# EAGLE schematic cem3350 iteration 3 opamp buffer cv 0.3 (EAGLE 9.3.0)
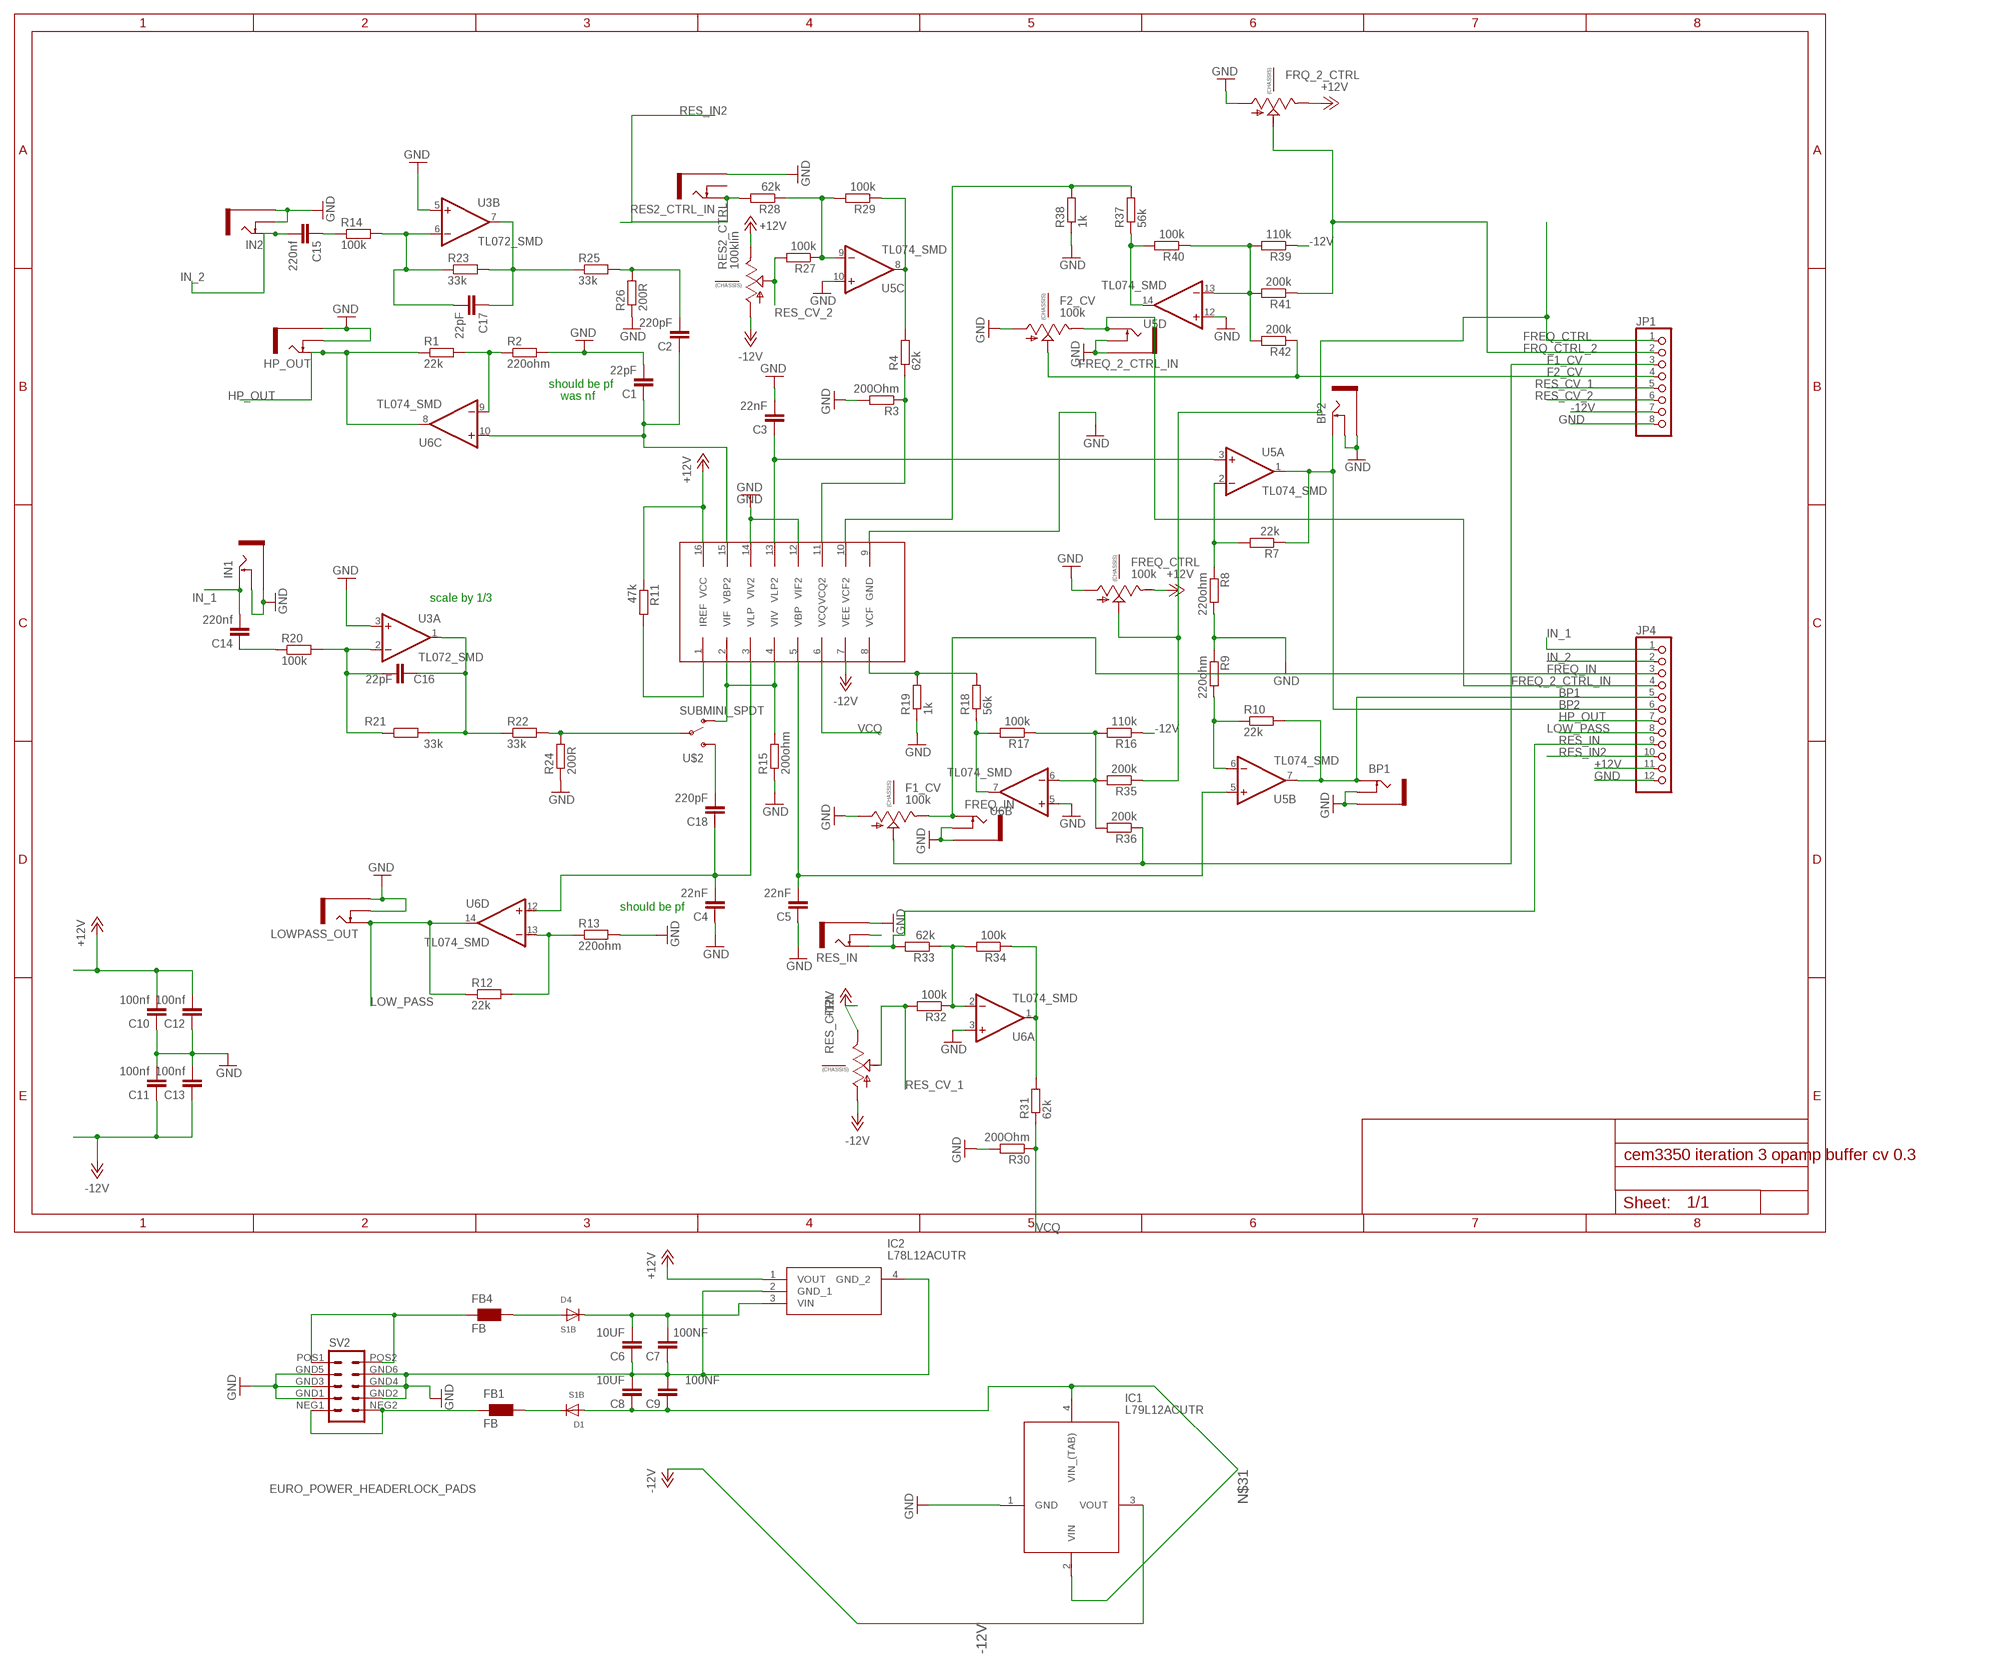
[diagram p0: schematic, sheet 1]

## Parts
BP1  THONKICONNNEW  [WQP-PJ301M-12_JACK]
BP2  THONKICONNNEW  [WQP-PJ301M-12_JACK]
C1  22pF  C-EUC0805  [C0805]
C2  220pF  C-EUC0805  [C0805]
C3  22nF  C-EUC0805  [C0805]
C4  22nF  C-EUC0805  [C0805]
C5  22nF  C-EUC0805  [C0805]
C6  10UF  C-EUC0805  [C0805]
C7  100NF  C-EUC0603  [C0603]
C8  10UF  C-EUC0805  [C0805]
C9  100NF  C-EUC0603  [C0603]
C10  100nf  C-EUC0603  [C0603]
C11  100nf  C-EUC0603  [C0603]
C12  100nf  C-EUC0603  [C0603]
C13  100nf  C-EUC0603  [C0603]
C14  220nf  C-EUC0805  [C0805]
C15  220nf  C-EUC0805  [C0805]
C16  22pF  C-EUC0805  [C0805]
C17  22pF  C-EUC0805  [C0805]
C18  220pF  C-EUC0805  [C0805]
D1  S1B  [SMADIODE]
D4  S1B  [SMADIODE]
F1_CV  100k  9MM_SNAP-IN_POT_CHASSIS  [9MM_SNAP-IN_POT]
F2_CV  100k  9MM_SNAP-IN_POT_CHASSIS  [9MM_SNAP-IN_POT]
FB1  FB  FERRITE_BEAD_0603  [WUERTH-ELEKTRONIK_0603]
FB4  FB  FERRITE_BEAD_0603  [WUERTH-ELEKTRONIK_0603]
FREQ_2_CTRL_IN  THONKICONNNEW  [WQP-PJ301M-12_JACK]
FREQ_CTRL  100k  9MM_SNAP-IN_POT_CHASSIS  [9MM_SNAP-IN_POT]
FREQ_IN  THONKICONNNEW  [WQP-PJ301M-12_JACK]
FRQ_2_CTRL  9MM_SNAP-IN_POT_CHASSIS  [9MM_SNAP-IN_POT]
HP_OUT  THONKICONNNEW  [WQP-PJ301M-12_JACK]
IC1  L79L12ACUTR  [ST-SOT-89]
IC2  L78L12ACUTR  [L78L12ACUTR]
IN1  THONKICONNNEW  [WQP-PJ301M-12_JACK]
IN2  THONKICONNNEW  [WQP-PJ301M-12_JACK]
JP1  PINHD-1X8  [1X08]
JP4  PINHD-1X12  [1X12]
LOWPASS_OUT  THONKICONNNEW  [WQP-PJ301M-12_JACK]
R1  22k  R-EU_R0805  [R0805]
R2  220ohm  R-EU_R0805  [R0805]
R3  200Ohm  R-EU_R0805  [R0805]
R4  62k  R-EU_R0805  [R0805]
R7  22k  R-EU_R0805  [R0805]
R8  220ohm  R-EU_R0805  [R0805]
R9  220ohm  R-EU_R0805  [R0805]
R10  22k  R-EU_R0805  [R0805]
R11  47k  R-EU_R0805  [R0805]
R12  22k  R-EU_R0805  [R0805]
R13  220ohm  R-EU_R0805  [R0805]
R14  100k  R-EU_R0805  [R0805]
R15  200ohm  R-EU_R0805  [R0805]
R16  110k  R-EU_R0805  [R0805]
R17  100k  R-EU_R0805  [R0805]
R18  56k  R-EU_R0805  [R0805]
R19  1k  R-EU_R0805  [R0805]
R20  100k  R-EU_R0805  [R0805]
R21  33k  R-EU_R0805  [R0805]
R22  33k  R-EU_R0805  [R0805]
R23  33k  R-EU_R0805  [R0805]
R24  200R  R-EU_R0805  [R0805]
R25  33k  R-EU_R0805  [R0805]
R26  200R  R-EU_R0805  [R0805]
R27  100k  R-EU_R0805  [R0805]
R28  62k  R-EU_R0805  [R0805]
R29  100k  R-EU_R0805  [R0805]
R30  200Ohm  R-EU_R0805  [R0805]
R31  62k  R-EU_R0805  [R0805]
R32  100k  R-EU_R0805  [R0805]
R33  62k  R-EU_R0805  [R0805]
R34  100k  R-EU_R0805  [R0805]
R35  200k  R-EU_R0805  [R0805]
R36  200k  R-EU_R0805  [R0805]
R37  56k  R-EU_R0805  [R0805]
R38  1k  R-EU_R0805  [R0805]
R39  110k  R-EU_R0805  [R0805]
R40  100k  R-EU_R0805  [R0805]
R41  200k  R-EU_R0805  [R0805]
R42  200k  R-EU_R0805  [R0805]
RES2_CTRL  100klin  9MM_SNAP-IN_POT_CHASSIS  [9MM_SNAP-IN_POT]
RES2_CTRL_IN  THONKICONNNEW  [WQP-PJ301M-12_JACK]
RES_CTRL  9MM_SNAP-IN_POT_CHASSIS  [9MM_SNAP-IN_POT]
RES_IN  THONKICONNNEW  [WQP-PJ301M-12_JACK]
SV2  EURO_POWER_HEADERLOCK_PADS  [EURO_PWR_HEADER_LOCK]
U3  TL072_SMD  [SO08]
U5  TL074_SMD  [SO14]
U6  TL074_SMD  [SO14]
U$1  CEM3350  [DIL16]
U$2  SUBMINI_SPDT  [SUBMINI_TOGGLE]

## Nets
+12V: C10.2 C12.2 FREQ_CTRL.3(E) FRQ_2_CTRL.3(E) IC2.1(VOUT) JP4.11 R11.1 RES2_CTRL.3(E) RES_CTRL.3(E) U$1.16(VCC)
-12V: C11.1 C13.1 IC1.3(VOUT) JP1.7 R16.1 R39.1 RES2_CTRL.1(A) RES_CTRL.1(A) U$1.7(VEE)
BP1: BP1.P$1_TIP(TIP) JP4.5 R10.2 U5.7(B:OUT)
BP2: BP2.P$1_TIP(TIP) JP4.6 R7.1 U5.1(A:OUT)
F1_CV: F1_CV.2(S) JP1.3 R36.1
F2_CV: F2_CV.2(S) JP1.4 R42.1
FREQ_2_CTRL_IN: F2_CV.3(E) FREQ_2_CTRL_IN.P$1_TIP(TIP) JP4.4
FREQ_CTRL: FREQ_CTRL.2(S) JP1.1 R35.1
FREQ_IN: F1_CV.3(E) FREQ_IN.P$1_TIP(TIP) JP4.3
FRQ_CTRL_2: FRQ_2_CTRL.2(S) JP1.2 R41.1
GND: BP1.P$2_SWITCH(SWITCH) BP1.P$3_SLEEVE(SLEEVE) BP2.P$2_SWITCH(SWITCH) BP2.P$3_SLEEVE(SLEEVE) C1.2 C3.2 C4.1 C5.1 C6.1 C7.1 C8.2 C9.2 C10.1 C11.2 C12.1 C13.2 F1_CV.1(A) F2_CV.1(A) FREQ_2_CTRL_IN.P$2_SWITCH(SWITCH) FREQ_2_CTRL_IN.P$3_SLEEVE(SLEEVE) FREQ_CTRL.1(A) FREQ_IN.P$2_SWITCH(SWITCH) FREQ_IN.P$3_SLEEVE(SLEEVE) FRQ_2_CTRL.1(A) HP_OUT.P$2_SWITCH(SWITCH) HP_OUT.P$3_SLEEVE(SLEEVE) IC1.1(GND) IC2.2(GND_1) IC2.4(GND_2) IN1.P$2_SWITCH(SWITCH) IN1.P$3_SLEEVE(SLEEVE) IN2.P$2_SWITCH(SWITCH) IN2.P$3_SLEEVE(SLEEVE) JP1.8 JP4.12 LOWPASS_OUT.P$2_SWITCH(SWITCH) LOWPASS_OUT.P$3_SLEEVE(SLEEVE) R2.2 R3.2 R8.2 R9.1 R13.2 R15.1 R19.1 R24.1 R26.1 R30.2 R38.1 RES2_CTRL_IN.P$3_SLEEVE(SLEEVE) RES_IN.P$3_SLEEVE(SLEEVE) SV2.GND1 SV2.GND2 SV2.GND3 SV2.GND4 SV2.GND5 SV2.GND6 U3.3(A:+IN) U3.5(B:+IN) U5.10(C:+IN) U5.12(D:+IN) U6.3(A:+IN) U6.5(B:+IN) U$1.9(GND) U$1.12(VIF2) U$1.14(VIV2)
HP_OUT: HP_OUT.P$1_TIP(TIP) JP4.7 R1.1 U6.8(C:OUT)
IN_1: C14.2 IN1.P$1_TIP(TIP) JP4.1
IN_2: C15.2 IN2.P$1_TIP(TIP) JP4.2
LOW_PASS: JP4.8 LOWPASS_OUT.P$1_TIP(TIP) R12.1 U6.14(D:OUT)
N$1: R11.2 U$1.1(IREF)
N$2: R1.2 R2.1 U6.9(C:-IN)
N$3: C2.2 R25.2 R26.2
N$4: R3.1 R4.1 U$1.11(VCQ2)
N$5: C1.1 C2.1 U6.10(C:+IN) U$1.15(VBP2)
N$6: R7.2 R8.1 U5.2(A:-IN)
N$7: C3.1 U5.3(A:+IN) U$1.13(VLP2)
N$9: R32.1 R33.1 R34.2 U6.2(A:-IN)
N$10: R37.2 R38.2 U$1.10(VCF2)
N$11: FB1.1 SV2.NEG1 SV2.NEG2
N$12: R9.2 R10.1 U5.6(B:-IN)
N$14: R18.2 R19.2 U$1.8(VCF)
N$16: C5.2 U5.5(B:+IN) U$1.5(VBP)
N$17: R22.2 R24.2 U$2.COM(COMMON)
N$18: FB4.1 SV2.POS1 SV2.POS2
N$19: C4.2 C18.1 U6.12(D:+IN) U$1.3(VLP)
N$20: R12.2 R13.1 U6.13(D:-IN)
N$22: D4.A FB4.2
N$23: D1.C FB1.2
N$26: C16.1 R21.2 R22.1 U3.1(A:OUT)
N$27: C14.1 R20.1
N$28: C16.2 R20.2 R21.1 U3.2(A:-IN)
N$29: C6.2 C7.2 D4.C IC2.3(VIN)
N$31: C8.1 C9.1 D1.A IC1.2(VIN) IC1.4(VIN_(TAB))
N$33: C15.1 R14.1
N$34: C17.2 R14.2 R23.1 U3.6(B:-IN)
N$35: C17.1 R23.2 R25.1 U3.7(B:OUT)
N$36: R4.2 R29.1 U5.8(C:OUT)
N$38: R27.1 R28.1 R29.2 U5.9(C:-IN)
N$40: RES_IN.P$2_SWITCH(SWITCH)
N$42: R31.2 R34.1 U6.1(A:OUT)
N$45: R17.2 R18.1 U6.7(B:OUT)
N$46: R16.2 R17.1 R35.2 R36.2 U6.6(B:-IN)
N$49: R15.2 U$1.2(VIF) U$1.4(VIV) U$2.1(O)
N$51: R37.1 R40.2 U5.14(D:OUT)
N$52: R39.2 R40.1 R41.2 R42.2 U5.13(D:-IN)
N$55: C18.2 U$2.3(S)
RES_CV_1: JP1.5 R32.2 RES_CTRL.2(S)
RES_CV_2: JP1.6 R27.2 RES2_CTRL.2(S)
RES_IN: JP4.9 R33.2 RES_IN.P$1_TIP(TIP)
RES_IN2: JP4.10 R28.2 RES2_CTRL_IN.P$1_TIP(TIP)
VCQ: R30.1 R31.1 U$1.6(VCQ)
Unconnected: F1_CV.CHASSIS1 F1_CV.CHASSIS2 F2_CV.CHASSIS1 F2_CV.CHASSIS2 FREQ_CTRL.CHASSIS1 FREQ_CTRL.CHASSIS2 FRQ_2_CTRL.CHASSIS1 FRQ_2_CTRL.CHASSIS2 RES2_CTRL.CHASSIS1 RES2_CTRL.CHASSIS2 RES2_CTRL_IN.P$2_SWITCH(SWITCH) RES_CTRL.CHASSIS1 RES_CTRL.CHASSIS2

## Notes on the sheet
- should be pf
- was nf
- scale by 1/3
- should be pf

## Power pins joined to a net without a drawn wire
V+: U3.8(P:V+) U5.4(P:V+) U6.4(P:V+)
V-: U3.4(P:V-) U5.11(P:V-) U6.11(P:V-)

## Library data of the parts
BP1 BP2 FREQ_2_CTRL_IN FREQ_IN HP_OUT IN1 IN2 LOWPASS_OUT RES2_CTRL_IN RES_IN = MusicThingModular:THONKICONN: 3.5mm socket for Eurorack modular synths
C1-C18 = rcl:C-EU: CAPACITOR, European symbol; SPICEPREFIX: C
D1 D4 = Electrosmith-Semiconductors:S1B; BIN#: 12-006; IPN: S1B; MPN: S1B; PACKAGE: SMA
F1_CV F2_CV FREQ_CTRL FRQ_2_CTRL RES2_CTRL RES_CTRL = MusicThingModular:9MM_SNAP-IN_POT_CHASSIS: 9mm vertical snap-in pot, Alpha / Panasonic style, with a connection to the metal chassis for grounding
FB1 FB4 = Electrosmith-Passives:FERRITE_BEAD: SMD EMI Suppression Ferrite Beads - excellent anti-EMI properties - low DCR - impedances till 3000 ohms - rated current up to 6 A; BIN#: 8-047; IPN: FB R0603; MPN: MI0603J601R-10; PACKAGE: R0603
IC1 = MusicThingModular:L79L12ACUTR: L79L12ACUTR, Voltage Regulator, Negative 0.1A -12 V, +/-5%, 4-Pin SOT-89 Source: Datasheet <https://www.st.com/resource/en/datasheet/l79l.pdf>; ARROW_PART_NUMBER: L79L12ACUTR; ARROW_PRICE-STOCK: https://www.arrow.com/en/products/l79l12acutr/stmicroelectronics; DESCRIPTION: L79L12ACUTR, Voltage Regulator, Negative 0.1A -12 V, +/-5%, 4-Pin SOT-89; HEIGHT: mm; MANUFACTURER_NAME: STMicroelectronics; MANUFACTURER_PART_NUMBER: L79L12ACUTR; MOUSER_PART_NUMBER: 511-L79L12ACU-TR; MOUSER_PRICE-STOCK: https://www.mouser.co.uk/ProductDetail/STMicroelectronics/L79L12ACUTR?qs=t0%252BWbrArM4MWNjS3Dlb5lQ%3D%3D
IC2 = MusicThingModular:L78L12ACUTR: Linear Voltage Regulators 12V 0.1A Positive Source: Datasheet <https://componentsearchengine.com/Datasheets/2/L78L12ACUTR.pdf>; ARROW_PART_NUMBER: L78L12ACUTR; ARROW_PRICE-STOCK: https://www.arrow.com/en/products/l78l12acutr/stmicroelectronics; DESCRIPTION: Linear Voltage Regulators 12V 0.1A Positive; HEIGHT: 1.6mm; MANUFACTURER_NAME: STMicroelectronics; MANUFACTURER_PART_NUMBER: L78L12ACUTR; MOUSER_PART_NUMBER: 511-L78L12ACU; MOUSER_PRICE-STOCK: https://www.mouser.co.uk/ProductDetail/STMicroelectronics/L78L12ACUTR?qs=lsQ%2Fasl43rq%252BGNm5TGwtyg%3D%3D
JP1 = pinhead:PINHD-1X8: PIN HEADER
JP4 = pinhead:PINHD-1X12: PIN HEADER
R1-R4 R7-R42 = rcl:R-EU_: RESISTOR, European symbol; SPICEPREFIX: R
SV2 = MusicThingModular:EURO_POWER_HEADER: Power Header 10 pin power header for Eurorack Power Supplies Variants with fatter pads for easier soldering, and the LOCK variant which has 5mil offset pins to hold the component in place before soldering
U3 = MusicThingModular:TL072: Generic Dual Op Amp
U5 U6 = MusicThingModular:TL074: Generic Quad Op Amp
U$1 = CEM:CEM3350
U$2 = MusicThingModular:SUBMINI_SPDT